# EAGLE design backlight (EAGLE 9.5.2)

## Sheet 1 of 2
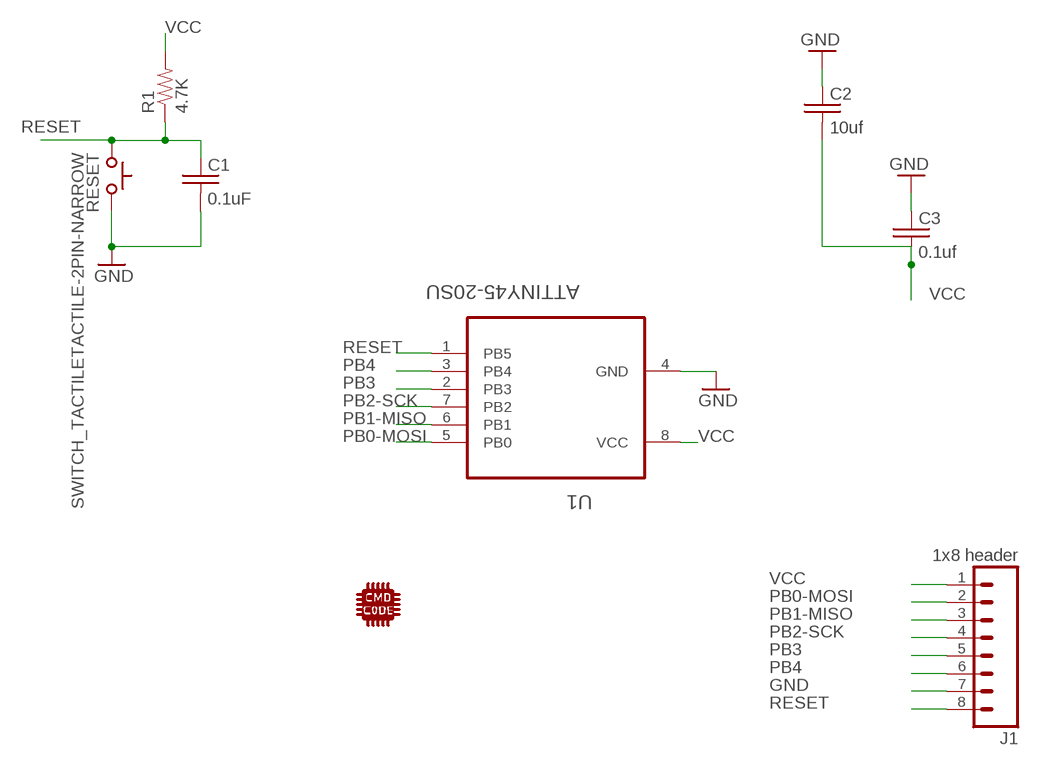
[diagram p0: schematic, sheet 1]

### Parts
C1  0.1uF  C-USC0805K  [C0805K]
C2  10uf  C-USC0805K  [C0805K]
C3  0.1uf  C-USC0805K  [C0805K]
J1  1x8 header  M08SILK_FEMALE_PTH  [1X08]
R1  4.7K  RESISTORR0805-RES  [R0805]
RESET  SWITCH_TACTILETACTILE-2PIN-NARROW  [TACTILE-2PIN-NARROW]
U1  ATTINY45-20SU  [SOIC127P798X216-8N]
U$17  CMD_C0DE_LOGOCMD_CODE_LOGO_TOP_COPPER  [CMD_C0DE_LOGO_TOP_COPPER]

### Nets
GND: C1.2 C2.1 C3.1 J1.7 RESET.P$1(A) U1.4(GND) ; also sheet 2
PB0-MOSI: J1.2 U1.5(PB0) ; also sheet 2
PB1-MISO: J1.3 U1.6(PB1)
PB2-SCK: J1.4 U1.7(PB2) ; also sheet 2
PB3: J1.5 U1.2(PB3)
PB4: J1.6 U1.3(PB4)
RESET: C1.1 J1.8 R1.1 RESET.P$2(C) U1.1(PB5)
VCC: C2.2 C3.2 J1.1 R1.2 U1.8(VCC) ; also sheet 2

## Sheet 2 of 2
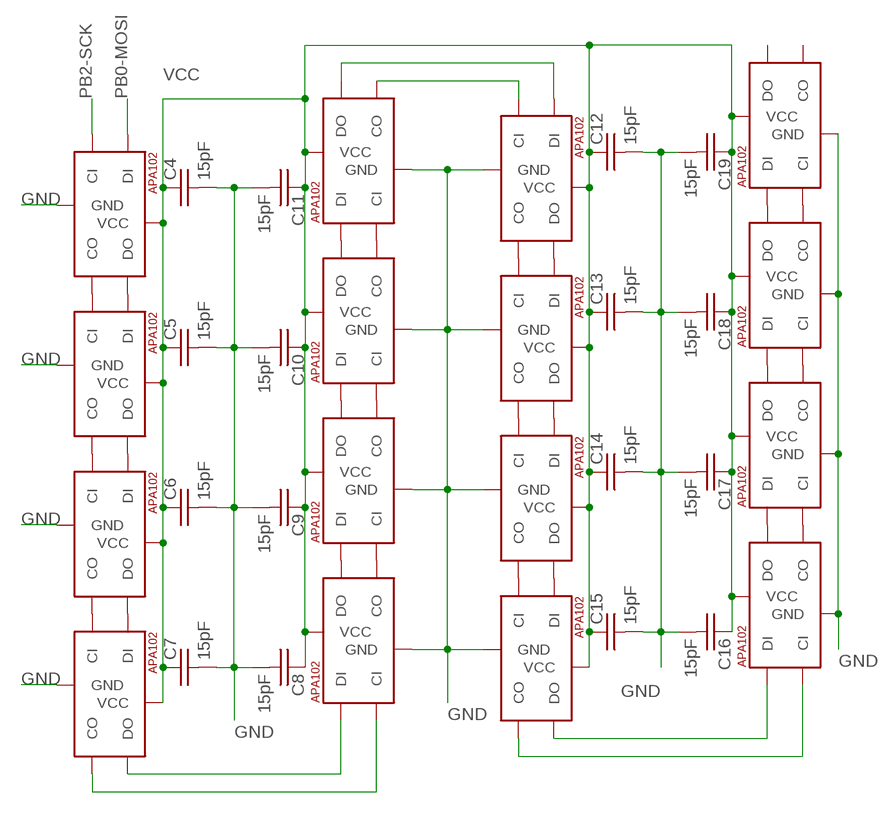
[diagram p1: schematic, sheet 2]

### Parts
C4  15pF  C-USC0805K  [C0805K]
C5  15pF  C-USC0805K  [C0805K]
C6  15pF  C-USC0805K  [C0805K]
C7  15pF  C-USC0805K  [C0805K]
C8  15pF  C-USC0805K  [C0805K]
C9  15pF  C-USC0805K  [C0805K]
C10  15pF  C-USC0805K  [C0805K]
C11  15pF  C-USC0805K  [C0805K]
C12  15pF  C-USC0805K  [C0805K]
C13  15pF  C-USC0805K  [C0805K]
C14  15pF  C-USC0805K  [C0805K]
C15  15pF  C-USC0805K  [C0805K]
C16  15pF  C-USC0805K  [C0805K]
C17  15pF  C-USC0805K  [C0805K]
C18  15pF  C-USC0805K  [C0805K]
C19  15pF  C-USC0805K  [C0805K]
U$1  APA1025050  [APA102_5050]
U$2  APA1025050  [APA102_5050]
U$3  APA1025050  [APA102_5050]
U$4  APA1025050  [APA102_5050]
U$5  APA1025050  [APA102_5050]
U$6  APA1025050  [APA102_5050]
U$7  APA1025050  [APA102_5050]
U$8  APA1025050  [APA102_5050]
U$9  APA1025050  [APA102_5050]
U$10  APA1025050  [APA102_5050]
U$11  APA1025050  [APA102_5050]
U$12  APA1025050  [APA102_5050]
U$13  APA1025050  [APA102_5050]
U$14  APA1025050  [APA102_5050]
U$15  APA1025050  [APA102_5050]
U$16  APA1025050  [APA102_5050]

### Nets
GND: C4.2 C5.2 C6.2 C7.2 C8.2 C9.2 C10.2 C11.2 C12.2 C13.2 C14.2 C15.2 C16.2 C17.2 C18.2 C19.2 U$1.6(GND) U$2.6(GND) U$3.6(GND) U$4.6(GND) U$5.6(GND) U$6.6(GND) U$7.6(GND) U$8.6(GND) U$9.6(GND) U$10.6(GND) U$11.6(GND) U$12.6(GND) U$13.6(GND) U$14.6(GND) U$15.6(GND) U$16.6(GND) ; also sheet 1
N$1: U$8.2(CO) U$9.5(CI)
N$2: U$8.3(DO) U$9.4(DI)
N$3: U$1.2(CO) U$2.5(CI)
N$4: U$1.3(DO) U$2.4(DI)
N$7: U$3.2(CO) U$4.5(CI)
N$8: U$3.3(DO) U$4.4(DI)
N$9: U$2.2(CO) U$3.5(CI)
N$10: U$2.3(DO) U$3.4(DI)
N$13: U$5.2(CO) U$6.5(CI)
N$14: U$5.3(DO) U$6.4(DI)
N$17: U$7.2(CO) U$8.5(CI)
N$18: U$7.3(DO) U$8.4(DI)
N$19: U$6.2(CO) U$7.5(CI)
N$20: U$6.3(DO) U$7.4(DI)
N$22: U$12.3(DO) U$13.4(DI)
N$23: U$9.2(CO) U$10.5(CI)
N$24: U$9.3(DO) U$10.4(DI)
N$25: U$12.2(CO) U$13.5(CI)
N$27: U$11.2(CO) U$12.5(CI)
N$28: U$11.3(DO) U$12.4(DI)
N$29: U$10.2(CO) U$11.5(CI)
N$30: U$10.3(DO) U$11.4(DI)
N$33: U$13.2(CO) U$14.5(CI)
N$34: U$13.3(DO) U$14.4(DI)
N$37: U$15.2(CO) U$16.5(CI)
N$38: U$15.3(DO) U$16.4(DI)
N$39: U$14.2(CO) U$15.5(CI)
N$40: U$14.3(DO) U$15.4(DI)
N$41: U$4.3(DO) U$5.4(DI)
N$42: U$4.2(CO) U$5.5(CI)
PB0-MOSI: U$1.4(DI) ; also sheet 1
PB2-SCK: U$1.5(CI) ; also sheet 1
VCC: C4.1 C5.1 C6.1 C7.1 C8.1 C9.1 C10.1 C11.1 C12.1 C13.1 C14.1 C15.1 C16.1 C17.1 C18.1 C19.1 U$1.1(VCC) U$2.1(VCC) U$3.1(VCC) U$4.1(VCC) U$5.1(VCC) U$6.1(VCC) U$7.1(VCC) U$8.1(VCC) U$9.1(VCC) U$10.1(VCC) U$11.1(VCC) U$12.1(VCC) U$13.1(VCC) U$14.1(VCC) U$15.1(VCC) U$16.1(VCC) ; also sheet 1
Unconnected: U$16.2(CO) U$16.3(DO)

## Library data of the parts
C1-C3 = name-in-lights:C-US: CAPACITOR, American symbol
C4-C19 = passives:C-US: CAPACITOR, American symbol
J1 = NameInLights:M08: Header 8 Standard 8-pin 0.1" header. Use with straight break away headers (SKU : PRT-00116), right angle break away headers (PRT-00553), swiss pins (PRT-00743), machine pins (PRT-00117), and female headers (PRT-00115).; PROD_ID: CONN-08438
R1 = passives:RESISTOR: Resistor Basic schematic elements and footprints for 0603, 1206, and PTH resistors.
RESET = NameInLights:SWITCH_TACTILE
U1 = ICs:ATTINY45-20SU: 8-bit Microcontroller with 4 Bytes In-System Programmable Flash; DESCRIPTION: ATtiny Series 20 MHz 4 KB Flash 256 B SRAM 8-Bit Microcontroller - SOIC-8; DIGI-KEY_PART_NUMBER: ATTINY45-20SU-ND; DIGI-KEY_PURCHASE_URL: https://www.digikey.com/product-detail/en/microchip-technology/ATTINY45-20SU/ATTINY45-20SU-ND/735466?utm_source=snapeda&utm_medium=aggregator&utm_campaign=symbol; MF: Microchip; MP: ATTINY45-20SU; PACKAGE: SOIC-8 Microchip
U$1-U$16 = leds:APA102: APA102C 5050 RGB LED -- Adafruit DotStar Single LED Pixel Product Page: https://www.adafruit.com/products/2343 Datasheet: https://cdn-shop.adafruit.com/product-files/2343/APA102C.pdf
U$17 = logos:CMD_C0DE_LOGO

## Board
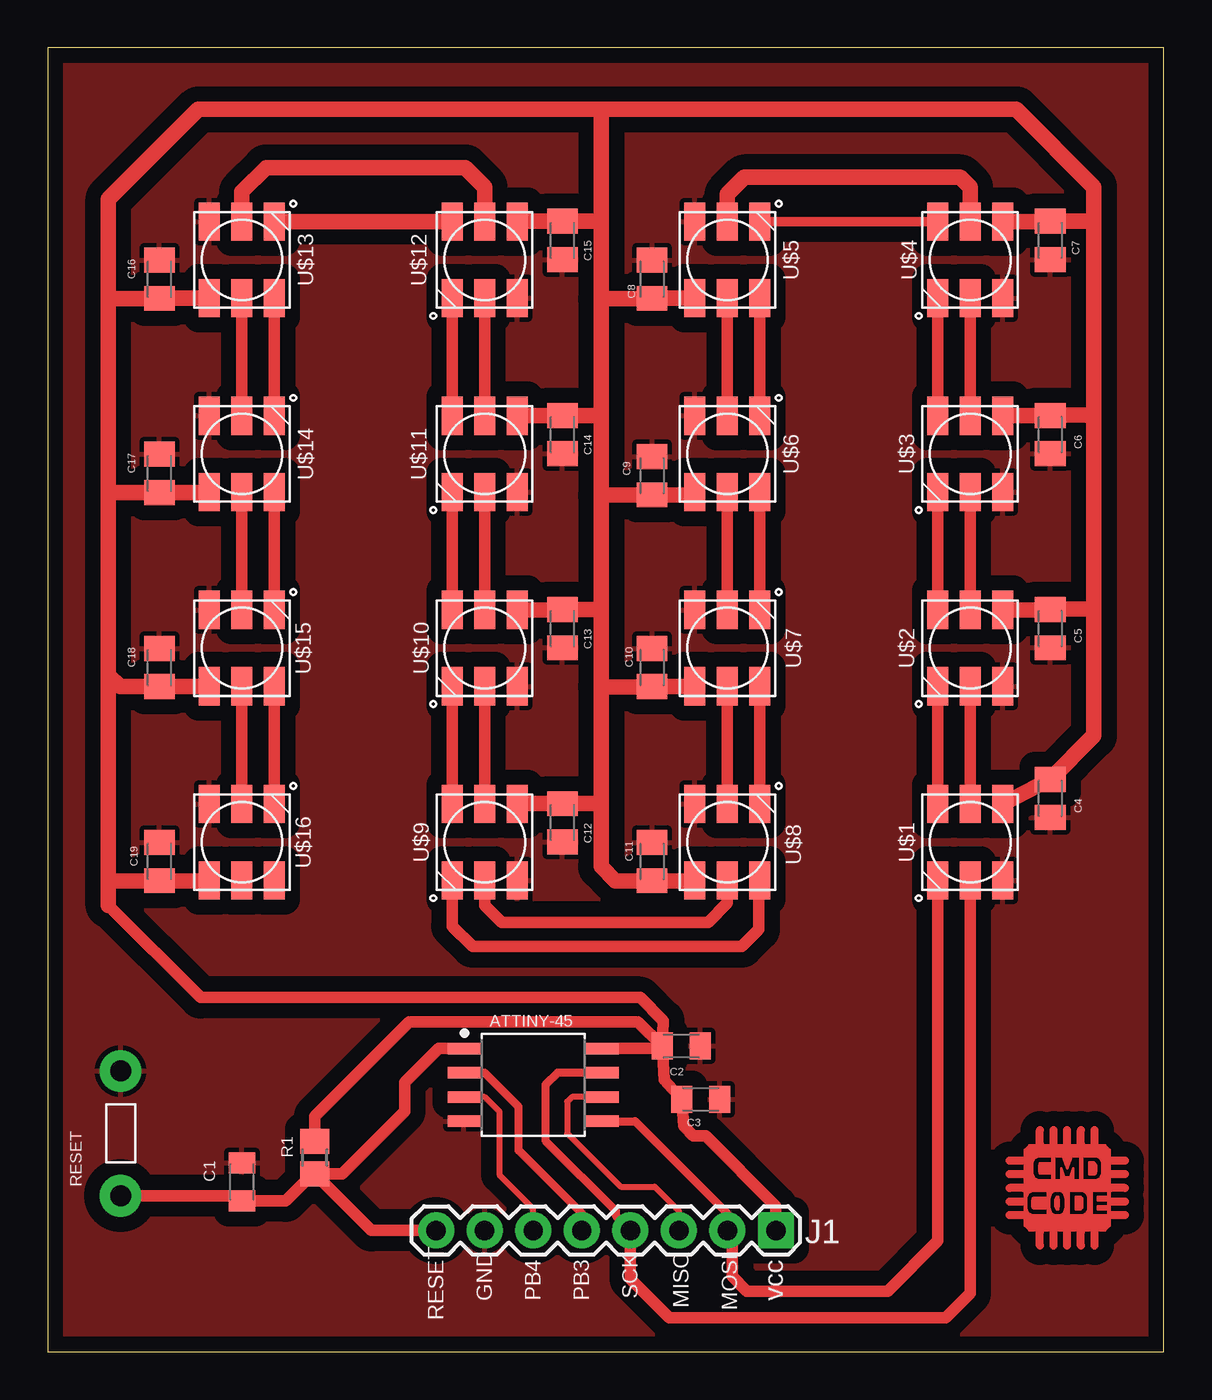
[diagram p2: board, top side]

Size 58.4 x 68.25 mm. Coordinates in mm from the lower left corner, seen from the top.
Outline: 0,0 58.4,0 58.4,68.25 0,68.25 0,0
Copper layers (1*16): Top 0.035559375mm / dielectric 1.6mm / Bottom 0.035559375mm
Design rules "oshpark-2layer": minimum track width 6mil, minimum drill 10mil, track to track 6mil, track to pad 6mil, pad to pad 6mil, via to via 6mil, smd to smd 6mil, copper to edge 15mil, drill to drill 6mil, minimum pad ring 5mil, minimum via ring 5mil, stop-mask expansion 2.5mil, vias tented up to drill 0mil, thermal gap 10mil

### Footprints (pad centres in the part's own frame; a part is rotated, then mirrored left to right if it is on the bottom)
C0805K = smd 1.1 x 1.4: 1 -1,0; 2 1,0
C0805K' = smd 1.3 x 1.6: 1 -1,0; 2 1,0
1X08 = drill 1.016 pad 1.88 square: 1 0,0 | drill 1.016 pad 1.88: 2 2.54,0; 3 5.08,0; 4 7.62,0; 5 10.16,0; 6 12.7,0; 7 15.24,0; 8 17.78,0
R0805 = smd 1.3 x 1.5: 1 -0.85,0; 2 0.85,0
TACTILE-2PIN-NARROW = drill 1.1 pad 2.184: P$1 3.264,0; P$2 -3.264,0
SOIC127P798X216-8N = smd 1.714 x 0.602: 1 -3.628,1.905; 2 -3.628,0.635; 3 -3.628,-0.635; 4 -3.628,-1.905; 5 3.628,-1.905; 6 3.628,-0.635; 7 3.628,0.635; 8 3.628,1.905
APA102_5050 = smd 2 x 1.1: 1 2,-1.7; 2 2,0; 3 2,1.7; 4 -2,1.7; 5 -2,0; 6 -2,-1.7

### Placement (x,y rotation side)
C1  10.16,8.89 90 top
C2  33.15,16 180 top
C3  34.16,13.21 180 top
C4  15pF  [C0805K']  52.45,28.96 270 top
C5  15pF  [C0805K']  52.45,37.85 270 top
C6  15pF  [C0805K']  52.45,48.01 270 top
C7  15pF  [C0805K']  52.45,58.17 270 top
C8  15pF  [C0805K']  31.62,56.13 90 top
C9  15pF  [C0805K']  31.62,45.85 90 top
C10  15pF  [C0805K']  31.62,35.81 90 top
C11  15pF  [C0805K']  31.62,25.65 90 top
C12  15pF  [C0805K']  26.92,27.69 270 top
C13  15pF  [C0805K']  26.92,37.85 270 top
C14  15pF  [C0805K']  26.92,48.01 270 top
C15  15pF  [C0805K']  26.92,58.17 270 top
C16  15pF  [C0805K']  5.84,56.13 90 top
C17  15pF  [C0805K']  5.84,45.97 90 top
C18  15pF  [C0805K']  5.84,35.81 90 top
C19  15pF  [C0805K']  5.84,25.65 90 top
J1  38.1,6.35 180 top
R1  13.97,10.16 90 top
RESET  3.81,11.43 90 top
U1  25.4,13.97 0 top
U$1  48.26,26.67 90 top
U$2  48.26,36.83 90 top
U$3  48.26,46.99 90 top
U$4  48.26,57.15 90 top
U$5  35.56,57.15 270 top
U$6  35.56,46.99 270 top
U$7  35.56,36.83 270 top
U$8  35.56,26.67 270 top
U$9  22.86,26.67 90 top
U$10  22.86,36.83 90 top
U$11  22.86,46.99 90 top
U$12  22.86,57.15 90 top
U$13  10.16,57.15 270 top
U$14  10.16,46.99 270 top
U$15  10.16,36.83 270 top
U$16  10.16,26.67 270 top
U$17  53.34,8.89 0 top

### Tracks (layer width: path | path; a pad name or v marks a point on that pad's centre or on a via)
GND
  pour Top (isolate 0.8): 0,68.58 0,0 58.42,0 58.42,68.58
N$1
  Top 0.61: U$8.2 35.56,23.5 34.54,22.48 23.75,22.48 22.86,23.37 U$9.5
N$2
  Top 0.61: U$9.4 21.16,22.27 22.23,21.21 36.32,21.21 37.21,22.1 37.21,24.62 U$8.3
N$3
  Top 0.61: U$1.2 U$2.5
N$4
  Top 0.61: U$1.3 U$2.4
N$7
  Top 0.61: U$3.2 U$4.5
N$8
  Top 0.61: U$3.3 U$4.4
N$9
  Top 0.61: U$2.2 U$3.5
N$10
  Top 0.61: U$2.3 U$3.4
N$13
  Top 0.61: U$5.2 U$6.5
N$14
  Top 0.61: U$5.3 U$6.4
N$17
  Top 0.61: U$8.5 U$7.2
N$18
  Top 0.61: U$7.3 U$8.4
N$19
  Top 0.61: U$6.2 U$7.5
N$20
  Top 0.61: U$6.3 U$7.4
N$22
  Top 0.813: U$12.3 U$13.4
N$23
  Top 0.61: U$9.2 U$10.5
N$24
  Top 0.61: U$9.3 U$10.4
N$25
  Top 0.813: U$12.2 22.86,60.96 21.84,61.98 11.43,61.98 10.16,60.71 U$13.5
N$27
  Top 0.61: U$11.2 U$12.5
N$28
  Top 0.61: U$12.4 U$11.3
N$29
  Top 0.61: U$10.2 U$11.5
N$30
  Top 0.61: U$10.3 U$11.4
N$33
  Top 0.61: U$13.2 U$14.5
N$34
  Top 0.61: U$13.3 U$14.4
N$37
  Top 0.61: U$15.2 U$16.5
N$38
  Top 0.61: U$15.3 U$16.4
N$39
  Top 0.61: U$14.2 U$15.5
N$40
  Top 0.61: U$14.3 U$15.4
N$41
  Top 0.508: U$4.3 U$5.4
N$42
  Top 0.813: U$4.2 48.26,60.96 47.75,61.47 36.45,61.47 35.56,60.58 U$5.5
PB0-MOSI
  Top 0.406: U1.5 30.73,12.06 35.56,7.24 J1.2 35.81,6.1
  Top 0.61: 35.81,6.1 35.81,3.94 36.58,3.17 43.94,3.17 46.56,5.79 U$1.4
PB1-MISO
  Top 0.305: U1.6 27.43,13.34 27.18,13.08 27.18,11.43 29.97,8.64 31.75,8.64 33.02,7.37 J1.3
PB2-SCK
  Top 0.406: U1.7 26.67,14.61 26.04,13.97 26.04,11.05 29.72,7.37 29.72,7.11 J1.4
  Top 0.61: J1.4 30.48,3.81 32.51,1.78 46.99,1.78 48.26,3.05 U$1.5
PB3
  Top 0.406: J1.5 27.94,7.24 24.64,10.54 24.64,12.83 22.86,14.61 U1.2
PB4
  Top 0.305: U1.3 22.86,13.34 23.62,12.57 23.62,9.27 25.4,7.49 J1.6
RESET
  Top 0.254: R1.1 13.87,9.31 | 9.99,8.17 C1.1 9.99,8.17
  Top 0.61: J1.8 16.93,6.35 R1.1 15.41,9.31 18.67,12.57 18.67,14.1 20.45,15.88 U1.1 | 9.99,8.17 RESET.P$2 | 13.87,9.31 12.45,7.89 C1.1
VCC
  Top 0.254: U$15.1 8.44,34.81 | U$14.1 8.44,44.97 | C17.1 5.83,44.96 | U$13.1 8.44,55.13 | C16.1 5.83,55.12 | U$12.1 24.58,59.17 | 28.94,59.17 28.96,59.18 | 33.84,24.65 U$8.1 | 28.94,49.01 28.96,49.02 | C14.1 26.91,48.99 | C13.1 26.91,38.83 | 28.81,38.85 28.96,38.99 | 24.58,28.69 U$9.1 | 28.84,28.69 28.96,28.57 | C10.1 31.61,34.8 | 33.84,34.81 U$7.1 | C9.1 31.61,44.83 | 33.72,44.85 U$6.1 | 33.84,55.13 U$5.1 | C8.1 31.61,55.12 | 52.44,29.94 C4.1 | 52.44,38.83 C5.1 52.47,38.86 | 52.44,48.99 C6.1 52.47,49.02 | 52.44,59.15 C7.1 52.47,59.18 | 32.13,15.88 C2.2
  Top 0.508: 8.44,24.65 U$16.1 | 3.41,24.65 3.17,24.89
  Top 0.61: 3.17,23.37 8,18.54 30.99,18.54 32.2,17.32 C2.2 | J1.1 38.1,7.62 34.42,11.3 33.78,11.3 33.27,11.81 C3.2 32.26,14.22 C2.2 | U1.8 32.13,15.88 | C2.2 30.88,17.27 18.91,17.27 13.97,12.33 R1.2
  Top 0.813: 3.17,35.43 3.17,44.96 | 3.17,44.96 3.17,55.12 | 3.17,55.12 3.17,60.33 7.87,65.02 28.96,65.02 | 28.96,55.12 28.96,59.18 28.96,65.02 | 28.96,55.12 28.96,49.02 28.96,44.83 | 28.96,44.83 28.96,38.99 28.96,34.8 | 28.96,34.8 28.96,28.57 28.96,25.4 29.7,24.65 C11.1 33.84,24.65 | 54.74,59.18 54.74,60.96 50.67,65.02 28.96,65.02 | 54.74,59.18 54.74,49.02 | 54.74,49.02 54.74,38.86 | 54.74,38.86 54.74,32.24 C4.1 | 8.44,34.81 C18.1 3.79,34.81 3.17,35.43 | 8.44,44.97 C17.1 | 5.83,44.96 3.17,44.96 | 8.44,55.13 C16.1 | 5.83,55.12 3.17,55.12 | 24.58,59.17 C15.1 28.94,59.17 | C14.1 28.94,49.01 | 26.91,48.99 U$11.1 | 26.91,38.83 U$10.1 | C13.1 28.81,38.85 | 24.58,28.69 C12.1 28.84,28.69 | 31.61,34.8 28.96,34.8 | C10.1 33.84,34.81 | 31.61,44.83 28.96,44.83 | C9.1 33.72,44.85 | C8.1 33.84,55.13 | 31.61,55.12 28.96,55.12 | U$1.1 52.44,29.94 | U$2.1 52.44,38.83 | 52.47,38.86 54.74,38.86 | U$3.1 52.44,48.99 | 52.47,49.02 54.74,49.02 | U$4.1 52.44,59.15 | 52.47,59.18 54.74,59.18 | 3.17,23.37 3.17,24.89 3.17,35.43 | 8.44,24.65 C19.1 3.41,24.65

### Text on the board
tNames: ATTINY-45 | GND | PB4 | PB3 | SCK | vcc | RESET | MISO | MOSI